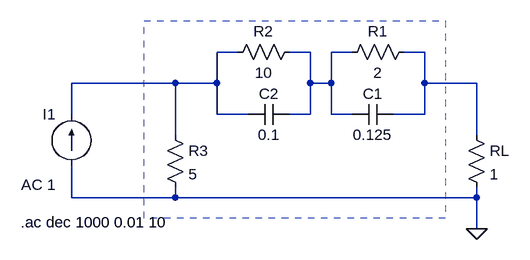
[diagram p0: schematic sim.asc]
sim.asc, the LTspice schematic file:
Version 4
SHEET 1 880 680
WIRE -48 96 -80 96
WIRE 64 96 32 96
WIRE 128 96 96 96
WIRE 240 96 208 96
WIRE -144 144 -304 144
WIRE -80 144 -80 96
WIRE -80 144 -144 144
WIRE 64 144 64 96
WIRE 96 144 96 96
WIRE 96 144 64 144
WIRE 240 144 240 96
WIRE 320 144 240 144
WIRE -304 192 -304 144
WIRE -80 192 -80 144
WIRE -32 192 -80 192
WIRE 64 192 64 144
WIRE 64 192 32 192
WIRE 96 192 96 144
WIRE 128 192 96 192
WIRE 240 192 240 144
WIRE 240 192 192 192
WIRE -144 224 -144 144
WIRE 320 224 320 144
WIRE -304 320 -304 272
WIRE -144 320 -144 304
WIRE -144 320 -304 320
WIRE 320 320 320 304
WIRE 320 320 -144 320
WIRE 320 368 320 320
FLAG 320 368 0
SYMBOL cap 192 176 R90
WINDOW 0 0 32 VBottom 2
WINDOW 3 32 32 VTop 2
SYMATTR InstName C1
SYMATTR Value 0.125
SYMBOL res 224 80 R90
WINDOW 0 0 56 VBottom 2
WINDOW 3 32 56 VTop 2
SYMATTR InstName R1
SYMATTR Value 2
SYMBOL res 304 208 R0
SYMATTR InstName RL
SYMATTR Value 1
SYMBOL res 48 80 R90
WINDOW 0 0 56 VBottom 2
WINDOW 3 32 56 VTop 2
SYMATTR InstName R2
SYMATTR Value 10
SYMBOL cap 32 176 R90
WINDOW 0 0 32 VBottom 2
WINDOW 3 32 32 VTop 2
SYMATTR InstName C2
SYMATTR Value 0.1
SYMBOL res -160 208 R0
SYMATTR InstName R3
SYMATTR Value 5
SYMBOL current -304 272 R180
WINDOW 0 24 80 Left 2
WINDOW 3 24 0 Left 2
WINDOW 123 24 -28 Left 2
WINDOW 39 0 0 Left 0
SYMATTR InstName I1
SYMATTR Value ""
SYMATTR Value2 AC 1
TEXT -382 358 Left 2 !.ac dec 1000 0.01 10
RECTANGLE Normal 272 352 -192 48 2

The netlist it stands for:
* sim.asc
C1 N003 N002 0.125
R1 N003 N002 2
RL N003 0 1
R2 N002 N001 10
C2 N002 N001 0.1
R3 N001 0 5
I1 0 N001 AC 1
.ac dec 1000 0.01 10
.backanno
.end